# Altium schematic sheet switch.SchDoc
size A4
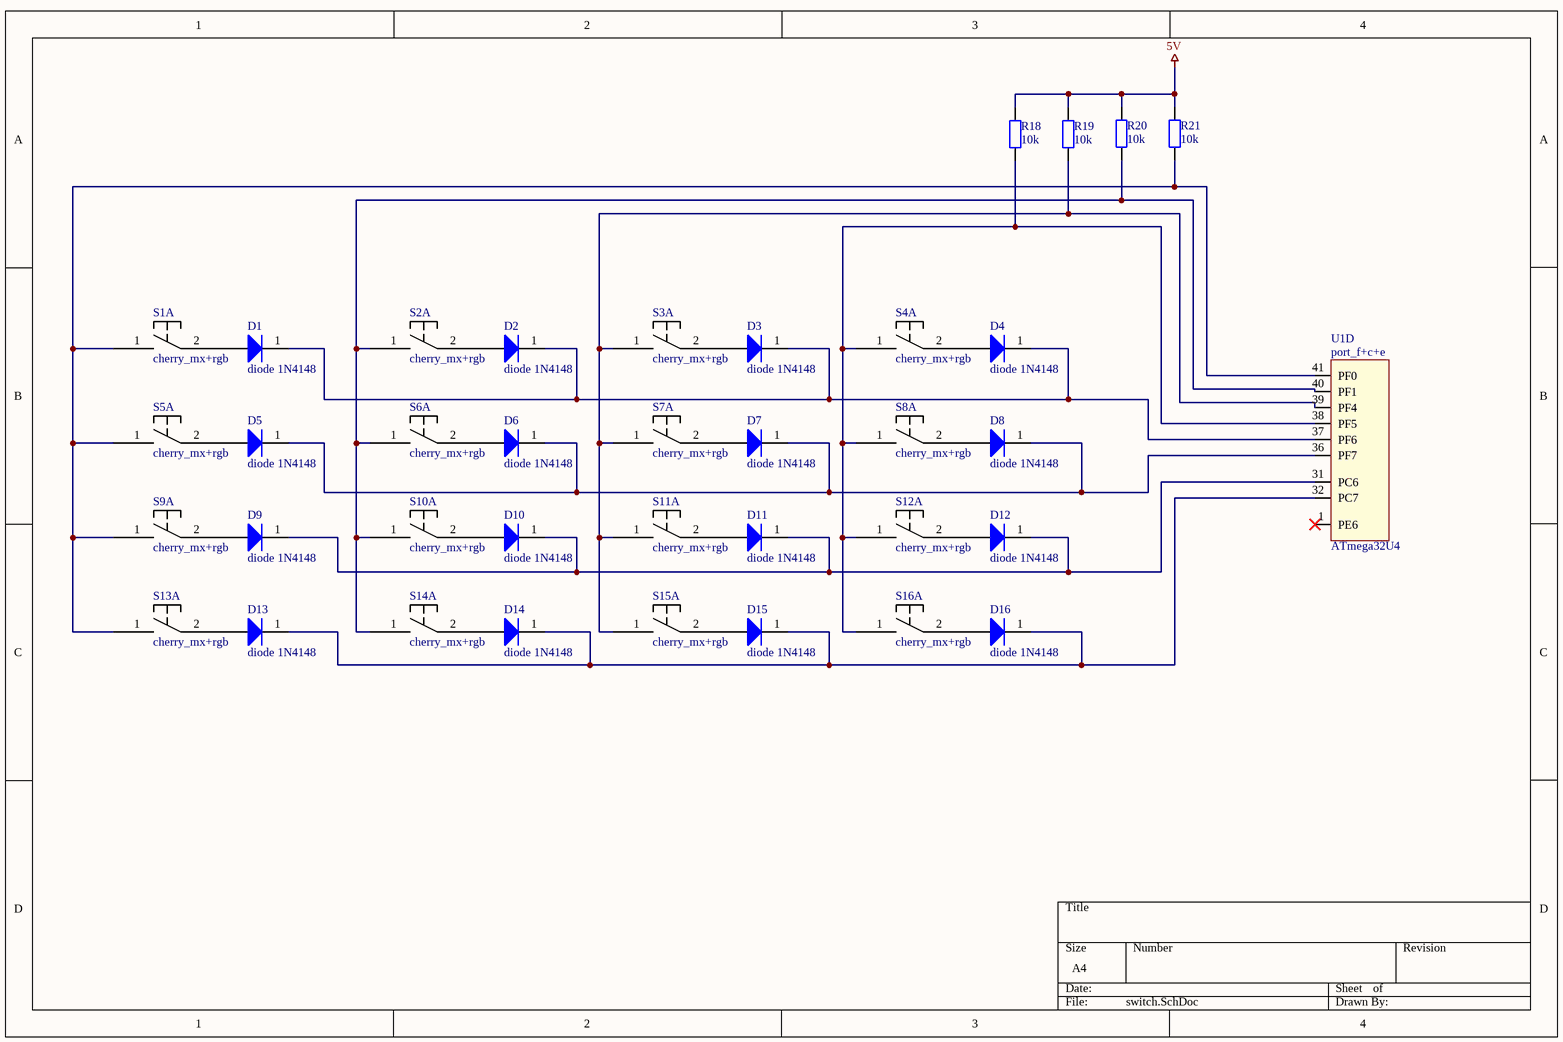
[diagram p0: switch.SchDoc]

## Parts
D1  diode 1N4148  [SOD-323_S130X260]
D2  diode 1N4148  [SOD-323_S130X260]
D3  diode 1N4148  [SOD-323_S130X260]
D4  diode 1N4148  [SOD-323_S130X260]
D5  diode 1N4148  [SOD-323_S130X260]
D6  diode 1N4148  [SOD-323_S130X260]
D7  diode 1N4148  [SOD-323_S130X260]
D8  diode 1N4148  [SOD-323_S130X260]
D9  diode 1N4148  [SOD-323_S130X260]
D10  diode 1N4148  [SOD-323_S130X260]
D11  diode 1N4148  [SOD-323_S130X260]
D12  diode 1N4148  [SOD-323_S130X260]
D13  diode 1N4148  [SOD-323_S130X260]
D14  diode 1N4148  [SOD-323_S130X260]
D15  diode 1N4148  [SOD-323_S130X260]
D16  diode 1N4148  [SOD-323_S130X260]
R18  10k  [0805]
R19  10k  [0805]
R20  10k  [0805]
R21  10k  [0805]
S1  cherry_mx+rgb  [kailh_socket_mx+led]  (part A of 2)
S2  cherry_mx+rgb  [kailh_socket_mx+led]  (part A of 2)
S3  cherry_mx+rgb  [kailh_socket_mx+led]  (part A of 2)
S4  cherry_mx+rgb  [kailh_socket_mx+led]  (part A of 2)
S5  cherry_mx+rgb  [kailh_socket_mx+led]  (part A of 2)
S6  cherry_mx+rgb  [kailh_socket_mx+led]  (part A of 2)
S7  cherry_mx+rgb  [kailh_socket_mx+led]  (part A of 2)
S8  cherry_mx+rgb  [kailh_socket_mx+led]  (part A of 2)
S9  cherry_mx+rgb  [kailh_socket_mx+led]  (part A of 2)
S10  cherry_mx+rgb  [kailh_socket_mx+led]  (part A of 2)
S11  cherry_mx+rgb  [kailh_socket_mx+led]  (part A of 2)
S12  cherry_mx+rgb  [kailh_socket_mx+led]  (part A of 2)
S13  cherry_mx+rgb  [kailh_socket_mx+led]  (part A of 2)
S14  cherry_mx+rgb  [kailh_socket_mx+led]  (part A of 2)
S15  cherry_mx+rgb  [kailh_socket_mx+led]  (part A of 2)
S16  cherry_mx+rgb  [kailh_socket_mx+led]  (part A of 2)
U1  ATmega32U4  [QFN44P05P7X7]  (part D of 5)

## Nets
5V: R18.2 R19.2 R20.2 R21.2
NetD1_1: D1.1(K) D2.1(K) D3.1(K) D4.1(K) U1.37(PF6)
NetD1_2: D1.2(A) S1.2
NetD2_2: D2.2(A) S2.2
NetD3_2: D3.2(A) S3.2
NetD4_2: D4.2(A) S4.2
NetD5_1: D5.1(K) D6.1(K) D7.1(K) D8.1(K) U1.36(PF7)
NetD5_2: D5.2(A) S5.2
NetD6_2: D6.2(A) S6.2
NetD7_2: D7.2(A) S7.2
NetD8_2: D8.2(A) S8.2
NetD9_1: D9.1(K) D10.1(K) D11.1(K) D12.1(K) U1.31(PC6)
NetD9_2: D9.2(A) S9.2
NetD10_2: D10.2(A) S10.2
NetD11_2: D11.2(A) S11.2
NetD12_2: D12.2(A) S12.2
NetD13_1: D13.1(K) D14.1(K) D15.1(K) D16.1(K) U1.32(PC7)
NetD13_2: D13.2(A) S13.2
NetD14_2: D14.2(A) S14.2
NetD15_2: D15.2(A) S15.2
NetD16_2: D16.2(A) S16.2
NetR18_1: R18.1 S4.1 S8.1 S12.1 S16.1 U1.38(PF5)
NetR19_1: R19.1 S3.1 S7.1 S11.1 S15.1 U1.39(PF4)
NetR20_1: R20.1 S2.1 S6.1 S10.1 S14.1 U1.40(PF1)
NetR21_1: R21.1 S1.1 S5.1 S9.1 S13.1 U1.41(PF0)

Not connected (* = marked no-connect by the designer): U1 1(PE6)*

## Notes on the sheet
- (in symbol ATmega32U4, part D) port_f+c+e

## Library data of the parts
R18-R21 = res0805